# Altium schematic sheet Sheet1.SchDoc
size A4; SheetNumber: 1; SheetTotal: 1
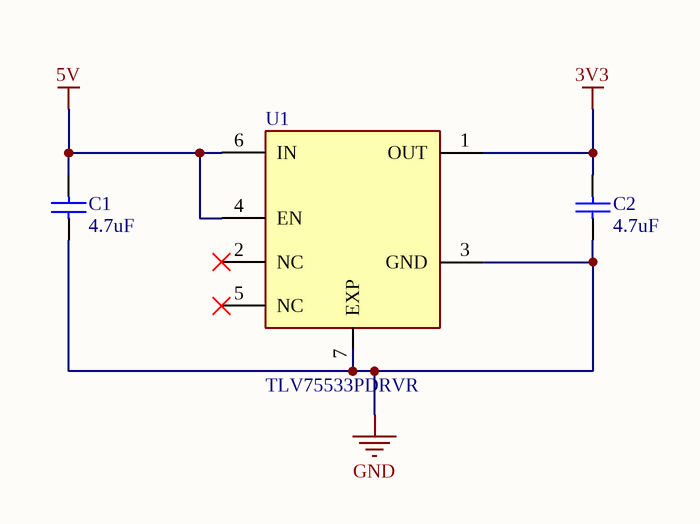
[diagram p0: Sheet1.SchDoc]

## Parts
C1  4.7uF  [CAP_0402]
C2  4.7uF  [CAP_0402]
U1  TLV75533PDRVR  [TLV75533PDRVR]

## Nets
3V3: C2.2 U1.1(OUT)
5V: C1.1 U1.4(EN) U1.6(IN)
GND: C1.2 C2.1 U1.3(GND) U1.7(EXP)

Not connected (* = marked no-connect by the designer): U1 2(NC)* 5(NC)*

## Library data of the parts
C1 C2 = CAP_0402: Capacitor SMD 0402 Generic, X5R or X7R; Manufacturer: *; Manufacturer Part Number: *; Tolerance: *; Package Size: *; LCSC Part Number: *
U1 = TLV75533PDRVR: 500mA high-PSRR low-IQ low-dropout voltage regulator with enable 6-WSON -40 to 125; Manufacturer: Texas Instruments; Manufacturer Lifecycle Status: ACTIVE; Accuracy: 1.5%; Dropout Voltage: 250mV; Max Junction Temperature (Tj): 125°C; Max Supply Voltage: 5.5V; Min Supply Voltage: 3.55V; Nominal Supply Current: 25µA; Number of Channels: 1; Output Voltage: 3.3V; Supplier: DigiKey; Supplier Part Number: 296-51807-6-ND; Manufacturer Part Number: TLV75533PDRVR; RoHS: Compliant; Category: LDO Voltage Regulators; Stock: 5358; Pricing: 1=0.45, 10=0.311, 25=0.2772, 100=0.24, 250=0.22232, 500=0.21166, 1000=0.20288 (USD); Height: 800µm; Length: 2mm; Lifecycle Status: Production; Max Operating Temperature: 125°C; Min Operating Temperature: -40°C; Number of Outputs: 1; Pins: 6; Output Current: 500mA; Schedule B: 8542390000; Thickness: 750µm; Width: 2mm; ComponentLink1URL: https://octopart.com:443/opatz8j6/c1?t=jz4KQYd-X30Q9oOq83RN8Q7LJxgnjgc-4qjjpnbq5ibPyNQ9C1qmgU9l-Mq4lcrjrxNSMc1fBezVCBvvAiMb2CiEwv4XU2kB3ULQci-AKl7rOna3sWz9khra6j3WMNF6umiBxhVnqs4fyYOWhNE2PFYe70JvyT66uIYe3PcBjJPV9rj2Op8s1nt1envjIjZVUY3LrhuEoL_oMCW_bmLoi1tQcpU6eGEV6lKc3ncBfJmEddXZsDRyU__fld6n-joR3AORBvJ_Vc3OVQhCrkfV5BDSB_Me-qjpyqejgDWvRq9frsyj1H2Z_N5iwNIFVTUaM6S0AsYGC3S5REzTpAfo67I7hxePwPhy6LENuZ1lk9DMUkgUFbrXIbVKEpYMLRYkCMjcSg&src-supplier=Texas+Instruments; ComponentLink1Description: https://octopart.com:443/opatz8j6/c1?t=jz4KQYd-X30Q9oOq83RN8Q7LJxgnjgc-4qjjpnbq5ibPyNQ9C1qmgU9l-Mq4lcrjrxNSMc1fBezVCBvvAiMb2CiEwv4XU2kB3ULQci-AKl7rOna3sWz9khra6j3WMNF6umiBxhVnqs4fyYOWhNE2PFYe70JvyT66uIYe3PcBjJPV9rj2Op8s1nt1envjIjZVUY3LrhuEoL_oMCW_bmLoi1tQcpU6eGEV6lKc3ncBfJmEddXZsDRyU__fld6n-joR3AORBvJ_Vc3OVQhCrkfV5BDSB_Me-qjpyqejgDWvRq9frsyj1H2Z_N5iwNIFVTUaM6S0AsYGC3S5REzTpAfo67I7hxePwPhy6LENuZ1lk9DMUkgUFbrXIbVKEpYMLRYkCMjcSg&src-supplier=Texas+Instruments; ComponentLink2URL: https://sigma.octopart.com:443/101810328/technical_drawing/Texas-Instruments-TLV75533PDRVR.pdf?src-supplier=Texas+Instruments; ComponentLink2Description: https://sigma.octopart.com:443/101810328/technical_drawing/Texas-Instruments-TLV75533PDRVR.pdf?src-supplier=Texas+Instruments; ComponentLink3URL: https://datasheet.octopart.com:443/TLV75533PDRVR-Texas-Instruments-datasheet-148775085.pdf?src-supplier=Upverter; ComponentLink3Description: https://datasheet.octopart.com:443/TLV75533PDRVR-Texas-Instruments-datasheet-148775085.pdf?src-supplier=Upverter; ComponentLink4URL: https://datasheet.octopart.com:443/TLV75533PDRVR-Texas-Instruments-datasheet-150455022.pdf?src-supplier=Augswan; ComponentLink4Description: https://datasheet.octopart.com:443/TLV75533PDRVR-Texas-Instruments-datasheet-150455022.pdf?src-supplier=Augswan; ComponentLink5URL: https://datasheet.octopart.com:443/TLV75533PDRVR-Texas-Instruments-datasheet-165804640.pdf?src-supplier=LCSC; ComponentLink5Description: https://datasheet.octopart.com:443/TLV75533PDRVR-Texas-Instruments-datasheet-165804640.pdf?src-supplier=LCSC; ComponentLink6URL: http://sigma.octopart.com:80/reach_statement/Texas-Instruments-company-64.pdf?src-supplier=Compliance+Statements; ComponentLink6Description: http://sigma.octopart.com:80/reach_statement/Texas-Instruments-company-64.pdf?src-supplier=Compliance+Statements; ComponentLink7URL: http://sigma.octopart.com:80/conflict_mineral_statement/Texas-Instruments-company-63.pdf?src-supplier=Compliance+Statements; ComponentLink7Description: http://sigma.octopart.com:80/conflict_mineral_statement/Texas-Instruments-company-63.pdf?src-supplier=Compliance+Statements; LCSC Part Number: *